# Altium schematic sheet CATS-FAT-Sensors.SchDoc: CATS Pro
size A4; Author: Luca Jost; Revision: 1.0; SheetNumber: 9; SheetTotal: 13; Subtitle: Sensor Overview
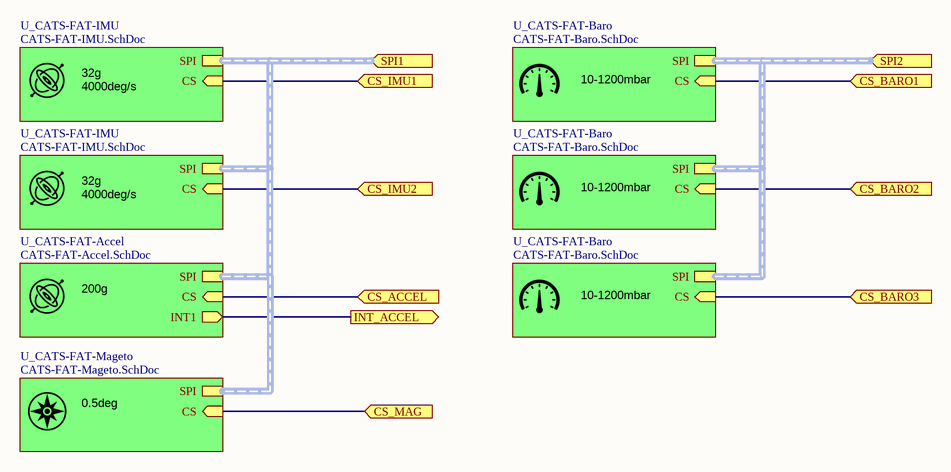
[diagram p0: CATS-FAT-Sensors.SchDoc]

## Sub-sheets
U_CATS-FAT-Accel = CATS-FAT-Accel.SchDoc: SPI (harness SPI), CS (in), INT1 (out)
U_CATS-FAT-Baro = CATS-FAT-Baro.SchDoc: SPI (harness SPI), CS (in)
U_CATS-FAT-Baro = CATS-FAT-Baro.SchDoc: SPI (harness SPI), CS (in)
U_CATS-FAT-Baro = CATS-FAT-Baro.SchDoc: SPI (harness SPI), CS (in)
U_CATS-FAT-IMU = CATS-FAT-IMU.SchDoc: SPI (harness SPI), CS (in)
U_CATS-FAT-IMU = CATS-FAT-IMU.SchDoc: SPI (harness SPI), CS (in)
U_CATS-FAT-Mageto = CATS-FAT-Mageto.SchDoc: SPI (harness SPI), CS (in)

## Ports
CS_ACCEL (in), CS_BARO1 (in), CS_BARO2 (in), CS_BARO3 (in), CS_IMU1 (in), CS_IMU2 (in), CS_MAG (in), INT_ACCEL (out), SPI1 (in), SPI2 (in)

## Nets
CS_ACCEL: port CS_ACCEL, sheet U_CATS-FAT-Accel/CS
CS_BARO1: port CS_BARO1, sheet U_CATS-FAT-Baro/CS
CS_BARO2: port CS_BARO2, sheet U_CATS-FAT-Baro/CS
CS_BARO3: port CS_BARO3, sheet U_CATS-FAT-Baro/CS
CS_IMU1: port CS_IMU1, sheet U_CATS-FAT-IMU/CS
CS_IMU2: port CS_IMU2, sheet U_CATS-FAT-IMU/CS
CS_MAG: port CS_MAG, sheet U_CATS-FAT-Mageto/CS
INT_ACCEL: port INT_ACCEL, sheet U_CATS-FAT-Accel/INT1

## Buses and harness runs
harness port SPI1 = sheet U_CATS-FAT-Accel/SPI = sheet U_CATS-FAT-IMU/SPI = sheet U_CATS-FAT-Mageto/SPI
harness port SPI2 = sheet U_CATS-FAT-Baro/SPI

## Notes on the sheet
- 4000deg/s
- 32g
- 10-1200mbar
- 200g
- 0.5deg
- Title
- Author:
- Subtitle
- Date:
- Rev:
- CATS
- Sheet
- of
- File: